# EAGLE design Flutter_ARM_R5_Basic (EAGLE 6.5.0)
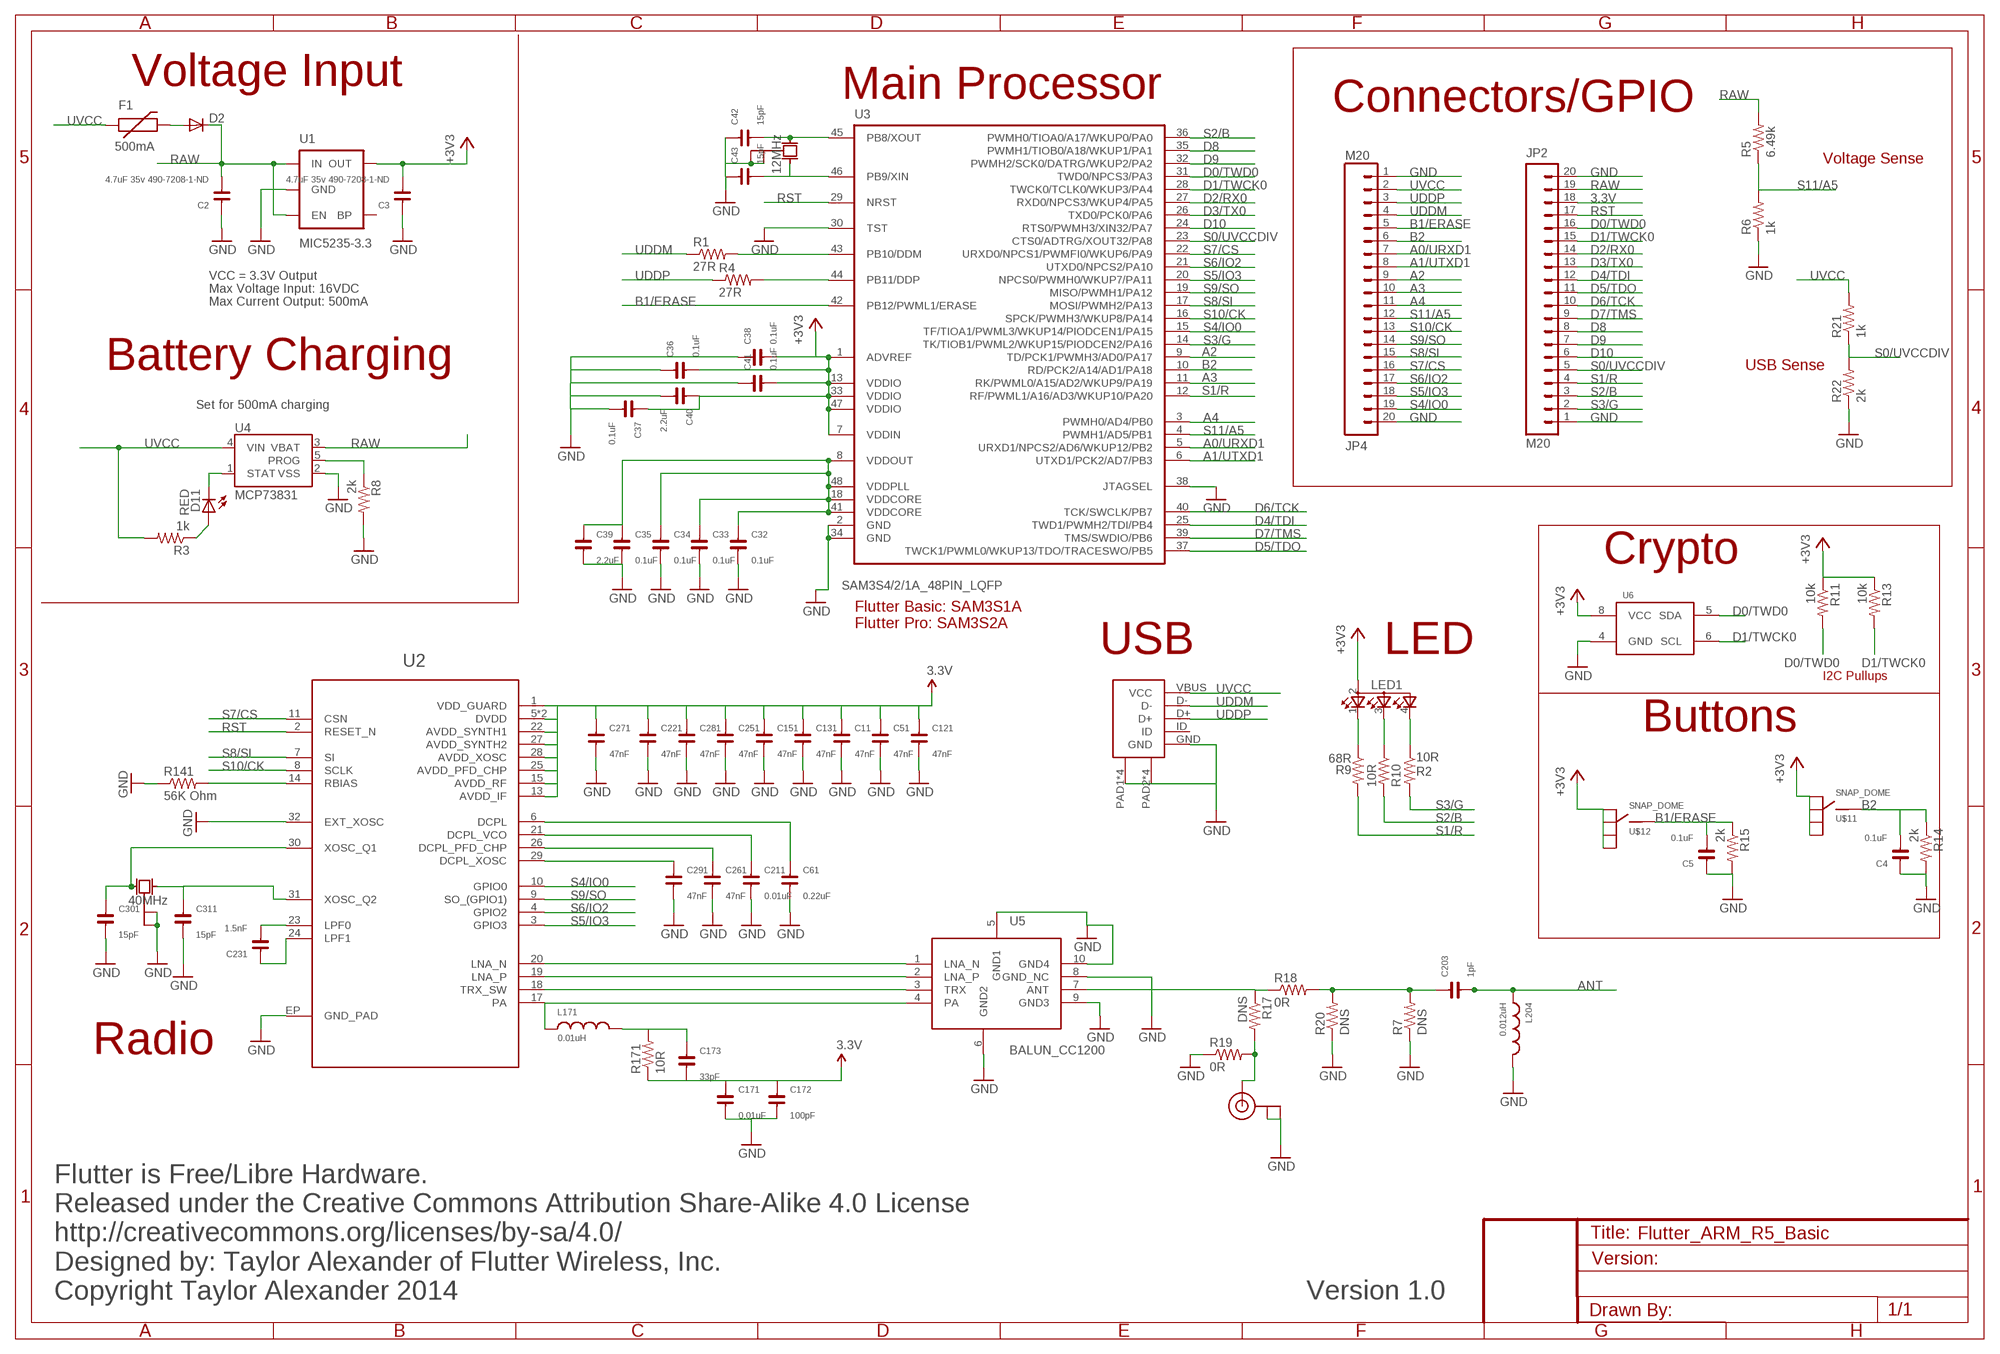
[diagram p0: schematic, sheet 1]

## Parts
C2  4.7uF 35v 490-7208-1-ND  CAPACITOR0805  [0808-CAP]
C3  4.7uF 35v 490-7208-1-ND  CAPACITOR0805  [0808-CAP]
C4  0.1uF  CAPACITOR0402  [0402-CAP]
C5  0.1uF  CAPACITOR0402  [0402-CAP]
C11  47nF  CAPACITOR0402  [0402-CAP]
C32  0.1uF  CAPACITOR0402  [0402-CAP]
C33  0.1uF  CAPACITOR0402  [0402-CAP]
C34  0.1uF  CAPACITOR0402  [0402-CAP]
C35  0.1uF  CAPACITOR0402  [0402-CAP]
C36  0.1uF  CAPACITOR0402  [0402-CAP]
C37  0.1uF  CAPACITOR0402  [0402-CAP]
C38  0.1uF  CAPACITOR0402  [0402-CAP]
C39  2.2uF  CAPACITOR0402  [0402-CAP]
C40  2.2uF  CAPACITOR0402  [0402-CAP]
C41  0.1uF  CAPACITOR0402  [0402-CAP]
C42  15pF  CAPACITOR0402  [0402-CAP]
C43  15pF  CAPACITOR0402  [0402-CAP]
C51  47nF  CAPACITOR0402  [0402-CAP]
C61  0.22uF  CAPACITOR0402  [0402-CAP]
C121  47nF  CAPACITOR0402  [0402-CAP]
C131  47nF  CAPACITOR0402  [0402-CAP]
C151  47nF  CAPACITOR0402  [0402-CAP]
C171  0.01uF  CAPACITOR0402  [0402-CAP]
C172  100pF  CAPACITOR0402  [0402-CAP]
C173  33pF  CAPACITOR0402  [0402-CAP]
C203  1pF  CAPACITOR0402  [0402-CAP]
C211  0.01uF  CAPACITOR0402  [0402-CAP]
C221  47nF  CAPACITOR0402  [0402-CAP]
C231  1.5nF  CAPACITOR0402  [0402-CAP]
C251  47nF  CAPACITOR0402  [0402-CAP]
C261  47nF  CAPACITOR0402  [0402-CAP]
C271  47nF  CAPACITOR0402  [0402-CAP]
C281  47nF  CAPACITOR0402  [0402-CAP]
C291  47nF  CAPACITOR0402  [0402-CAP]
C301  15pF  CAPACITOR0402  [0402-CAP]
C311  15pF  CAPACITOR0402  [0402-CAP]
D2  DIODESOD  [SOD-323]
D11  RED  LED0603  [LED-0603]
F1  500mA  PTC0603  [0603-PTC]
JP2  M20  [1X20]
JP4  M20  [1X20]
L171  0.01uH  INDUCTOR0402  [0402-IND]
L204  0.012uH  INDUCTOR0402  [0402-IND]
LED1  TOPLED-3  [P-LCC-4-3]
R1  27R  RESISTOR0402  [0402-RES]
R2  10R  RESISTOR0402  [0402-RES]
R3  1k  RESISTOR0402  [0402-RES]
R4  27R  RESISTOR0402  [0402-RES]
R5  6.49k  RESISTOR0402  [0402-RES]
R6  1k  RESISTOR0402  [0402-RES]
R7  DNS  RESISTOR0402  [0402-RES]
R8  2k  RESISTOR0402  [0402-RES]
R9  68R  RESISTOR0402  [0402-RES]
R10  10R  RESISTOR0402  [0402-RES]
R11  10k  RESISTOR0402  [0402-RES]
R13  10k  RESISTOR0402  [0402-RES]
R14  2k  RESISTOR0402  [0402-RES]
R15  2k  RESISTOR0402  [0402-RES]
R17  DNS  RESISTOR0402  [0402-RES]
R18  0R  RESISTOR0402  [0402-RES]
R19  0R  RESISTOR0402  [0402-RES]
R20  DNS  RESISTOR0402  [0402-RES]
R21  1k  RESISTOR0402  [0402-RES]
R22  2k  RESISTOR0402  [0402-RES]
R141  56K Ohm  RESISTOR0402  [0402-RES]
R171  10R  RESISTOR0402  [0402-RES]
U1  MIC5235-3.3  V_REG_LDOSMD  [SOT23-5]
U2  CC1200  [QFN-32]
U3  SAM3S4/2/1A_48PIN_LQFP  [LQFP48]
U4  MCP73831  [SOT23-5]
U5  BALUN_CC1200  [IPC_BALUN_CC1200]
U6  ATSHA204/ATECC108UDFN  [UDFN_8_ATSHA204]
U7  U.FL  [U.FL]
U$2  MICRO_USB  [MICRO-USB-SLOT-2]
U$11  SNAP_DOME  [12MM_SNAP_DOME_SMALLER]
U$12  SNAP_DOME  [12MM_SNAP_DOME_SMALLER]
X1  12MHz  XTAL_ABRACON_4_PINABM8G  [XTAL_ABRACON_ABM8G_3.2MMX2.5MM]
X2  40MHz  XTAL_ABRACON_4_PINEPSON  [XTAL_EPSON_FA_128_2MMX1.6MM]

## Nets
3.3V: C3.2 C11.1 C36.2 C37.1 C38.2 C40.1 C41.2 C51.1 C121.1 C131.1 C151.1 C171.1 C172.1 C173.2 C221.1 C251.1 C271.1 C281.1 JP2.18 LED1.2(A2) R11.1 R13.1 R171.1 U1.5(OUT) U2.1(VDD_GUARD) U2.5(DVDD) U2.12(DVDD) U2.13(AVDD_IF) U2.15(AVDD_RF) U2.22(AVDD_SYNTH1) U2.25(AVDD_PFD_CHP) U2.27(AVDD_SYNTH2) U2.28(AVDD_XOSC) U3.1(ADVREF) U3.7(VDDIN) U3.13(VDDIO) U3.33(VDDIO) U3.47(VDDIO) U6.8(VCC) U$11.P$1 U$11.P$2 U$11.P$3 U$11.P$4 U$12.P$1 U$12.P$2 U$12.P$3 U$12.P$4 ; supply symbol labelled +3V3
+1.8V [Power]: C32.1 C33.1 C34.1 C35.1 C39.1 U3.8(VDDOUT) U3.18(VDDCORE) U3.41(VDDCORE) U3.48(VDDPLL)
A0/URXD1: JP4.7 U3.5(URXD1/NPCS2/AD6/WKUP12/PB2)
A1/UTXD1: JP4.8 U3.6(UTXD1/PCK2/AD7/PB3)
A2: JP4.9 U3.9(TD/PCK1/PWMH3/AD0/PA17)
A3: JP4.10 U3.11(RK/PWML0/A15/AD2/WKUP9/PA19)
A4: JP4.11 U3.3(PWMH0/AD4/PB0)
ANT: C203.2 L204.1
B1/ERASE: C5.2 JP4.5 R15.1 U3.42(PB12/PWML1/ERASE) U$12.CENTER
B2: C4.2 JP4.6 R14.1 U3.10(RD/PCK2/A14/AD1/PA18) U$11.CENTER
D0/TWD0: JP2.16 R11.2 U3.31(TWD0/NPCS3/PA3) U6.5(SDA)
D1/TWCK0: JP2.15 R13.2 U3.28(TWCK0/TCLK0/WKUP3/PA4) U6.6(SCL)
D2/RX0: JP2.14 U3.27(RXD0/NPCS3/WKUP4/PA5)
D3/TX0: JP2.13 U3.26(TXD0/PCK0/PA6)
D4/TDI: JP2.12 U3.25(TWD1/PWMH2/TDI/PB4)
D5/TDO: JP2.11 U3.37(TWCK1/PWML0/WKUP13/TDO/TRACESWO/PB5)
D6/TCK: JP2.10 U3.40(TCK/SWCLK/PB7)
D7/TMS: JP2.9 U3.39(TMS/SWDIO/PB6)
D8: JP2.8 U3.35(PWMH1/TIOB0/A18/WKUP1/PA1)
D9: JP2.7 U3.32(PWMH2/SCK0/DATRG/WKUP2/PA2)
D10: JP2.6 U3.24(RTS0/PWMH3/XIN32/PA7)
GND [Power]: C2.1 C3.1 C4.1 C5.1 C11.2 C32.2 C33.2 C34.2 C35.2 C36.1 C37.2 C38.1 C39.2 C40.2 C41.1 C42.1 C43.1 C51.2 C61.2 C121.2 C131.2 C151.2 C171.2 C172.2 C211.2 C221.2 C251.2 C261.2 C271.2 C281.2 C291.2 C301.2 C311.2 JP2.1 JP2.20 JP4.1 JP4.20 L204.2 R6.1 R7.1 R8.2 R14.2 R15.2 R19.1 R20.1 R22.1 R141.1 U1.2(GND) U2.32(EXT_XOSC) U2.EP(GND_PAD) U3.2(GND) U3.30(TST) U3.34(GND) U3.38(JTAGSEL) U4.2(VSS) U5.5(GND1) U5.6(GND2) U5.8(GND_NC) U5.9(GND3) U5.10(GND4) U6.4(GND) U7.P$1(GND) U7.P$2(GND) U$2.GND U$2.PAD1 U$2.PAD2 U$2.PAD3 U$2.PAD4 U$2.PAD5 U$2.PAD6 U$2.PAD7 U$2.PAD8 X1.P$2(GND) X1.P$4(GND) X2.2(GND) X2.4(GND)
LNA_N: U2.20(LNA_N) U5.1(LNA_N)
LNA_P: U2.19(LNA_P) U5.2(LNA_P)
N$1: C61.1 U2.6(DCPL)
N$2: R141.2 U2.14(RBIAS)
N$3: C231.1 U2.24(LPF1)
N$4: C231.2 U2.23(LPF0)
N$5: C211.1 U2.21(DCPL_VCO)
N$6: D11.A R3.1
N$7: C173.1 L171.2 R171.2
N$8: C203.1 R7.2 R18.2 R20.2
N$10: D2.2(A) F1.2
N$11: R17.1 R18.1 U5.7(ANT)
N$13: R17.2 R19.2 U7.P$3(SIGNAL)
N$14: C311.1 U2.31(XOSC_Q2) X2.1(X1)
N$15: C261.1 U2.26(DCPL_PFD_CHP)
N$16: C301.1 U2.30(XOSC_Q1) X2.3(X2)
N$17: C291.1 U2.29(DCPL_XOSC)
N$18: LED1.1(CRED) R9.1
N$20: LED1.4(CGREEN) R2.1
N$35: C42.2 U3.45(PB8/XOUT) X1.P$3(X2)
N$36: C43.2 U3.46(PB9/XIN) X1.P$1(X1)
PA: L171.1 U2.17(PA) U5.4(PA)
PROG: R8.1 U4.5(PROG)
RAW [Power]: C2.2 D2.1(C) JP2.19 R5.2 U1.1(IN) U1.3(EN) U4.3(VBAT)
RST: JP2.17 U2.2(RESET_N) U3.29(NRST)
S0/UVCCDIV: JP2.5 R21.1 R22.2 U3.23(CTS0/ADTRG/XOUT32/PA8)
S1/R: JP2.4 R9.2 U3.12(RF/PWML1/A16/AD3/WKUP10/PA20)
S2/B: JP2.3 R10.2 U3.36(PWMH0/TIOA0/A17/WKUP0/PA0)
S3/G: JP2.2 R2.2 U3.14(TK/TIOB1/PWML2/WKUP15/PIODCEN2/PA16)
S4/IO0: JP4.19 U2.10(GPIO0) U3.15(TF/TIOA1/PWML3/WKUP14/PIODCEN1/PA15)
S5/IO3: JP4.18 U2.3(GPIO3) U3.20(NPCS0/PWMH0/WKUP7/PA11)
S6/IO2: JP4.17 U2.4(GPIO2) U3.21(UTXD0/NPCS2/PA10)
S7/CS: JP4.16 U2.11(CSN) U3.22(URXD0/NPCS1/PWMFI0/WKUP6/PA9)
S8/SI: JP4.15 U2.7(SI) U3.17(MOSI/PWMH2/PA13)
S9/SO: JP4.14 U2.9(SO_(GPIO1)) U3.19(MISO/PWMH1/PA12)
S10/CK: JP4.13 U2.8(SCLK) U3.16(SPCK/PWMH3/WKUP8/PA14)
S11/A5: JP4.12 R5.1 R6.2 U3.4(PWMH1/AD5/PB1)
STAT: D11.C U4.1(STAT)
TRX_SW: U2.18(TRX_SW) U5.3(TRX)
U7: LED1.3(CBLUE) R10.1
UDDC_+: R4.2 U3.44(PB11/DDP)
UDDC_-: R1.2 U3.43(PB10/DDM)
UDDM: JP4.4 R1.1 U$2.D-
UDDP: JP4.3 R4.1 U$2.D+
UVCC: F1.1 JP4.2 R3.2 R21.2 U4.4(VIN) U$2.VBUS(VCC)
Unconnected: U1.4(BP) U$2.ID

## Notes on the sheet
- Voltage Input | Main Processor
- Connectors/GPIO
- Voltage Sense
- VCC = 3.3V Output
- Max Voltage Input: 16VDC
- Max Current Output: 500mA
- Battery Charging | USB Sense
- Set for 500mA charging
- Crypto
- Flutter Basic: SAM3S1A
  Flutter Pro: SAM3S2A
- USB | LED
- I2C Pullups
- Buttons
- Radio
- Flutter is Free/Libre Hardware.
  Released under the Creative Commons Attribution Share-Alike 4.0 License
  http://creativecommons.org/licenses/by-sa/4.0/
  Designed by: Taylor Alexander of Flutter Wireless, Inc.
  Copyright Taylor Alexander 2014
- Version 1.0

## Library data of the parts
C2-C5 C11 C32-C43 C51 C61 C121 C131 C151 C171-C173 C203 C211 C221 C231 C251 C261 C271 C281 C291 C301 C311 = Taylor:CAPACITOR
D2 = SparkFun:DIODE: Diode These are standard reverse protection diodes and small signal diodes. SMA package can handle up to about 1A. SOD-323 can handle about 200mA. What the SOD-323 package when ordering, there are some mfgs out there that are 5-pin packages.
D11 = SparkFun:LED: LEDs Standard schematic elements and footprints for 5mm, 3mm, 1206, and 0603 sized LEDs. 5mm - Spark Fun Electronics SKU : COM-00529 (and others)
F1 = Taylor:PTC: Resettable Fuse PTC Resettable Fuse. 0603 model is Bourns MF-FSMF Series like MF-FSMF050X-2
JP2 JP4 = SparkFun:M20: This is just like the LOCK variant in that the holes are staggared by 5 mil, but except for the last two holes. They are not altered from the "standard" footprint layout. This is used for a special purpose on the layout of our Graphic LCD Backpack. Make sure you want to use this device before selecting it for you project!
L171 L204 = Taylor:INDUCTOR: SRR1260_SMD_INDUCTOR http://www.bourns.com/data/global/PDFs/SRR1260.pdf 1uH-1000uH
LED1 = Taylor:TOPLED-3: http://www.us.sunled.com/products/spec/XZMDKCBDDG45S-9.pdf
R1-R11 R13-R15 R17-R22 R141 R171 = Taylor:RESISTOR: Resistor Basic schematic elements and footprints for 0603, 1206, and PTH 1/10th watt (small) resistors.
U1 = SparkFun:V_REG_LDO: Voltage Regulator LDO Standard 150mA LDO voltage regulator in SOT-23 layout. Micrel part MIC5205. BP (by-pass) pin is used to lower output noise with 470pF cap.
U2 = Taylor:CC1200
U3 = Taylor:SAM3S4/2/1A_48PIN_LQFP
U4 = SparkFun:MCP73831: Microchip's MCP73831 Miniature single cell, fully integrated Li-Ion, Li-polymer charge management controller http://ww1.microchip.com/downloads/en/DeviceDoc/21984a.pdf
U5 = Taylor:BALUN_CC1200
U6 = Taylor:ATSHA204/ATECC108
U7 = SparkFun:U.FL
U$2 = Taylor:MICRO_USB
U$11 U$12 = Taylor:SNAP_DOME
X1 X2 = Taylor:XTAL_ABRACON_4_PIN

## Net classes
0 default: width 0.152 mm, drill 0.152 mm, clearance 0.102 mm
1 Power: width 0.203 mm, drill 0.152 mm, clearance 0.102 mm

## Board
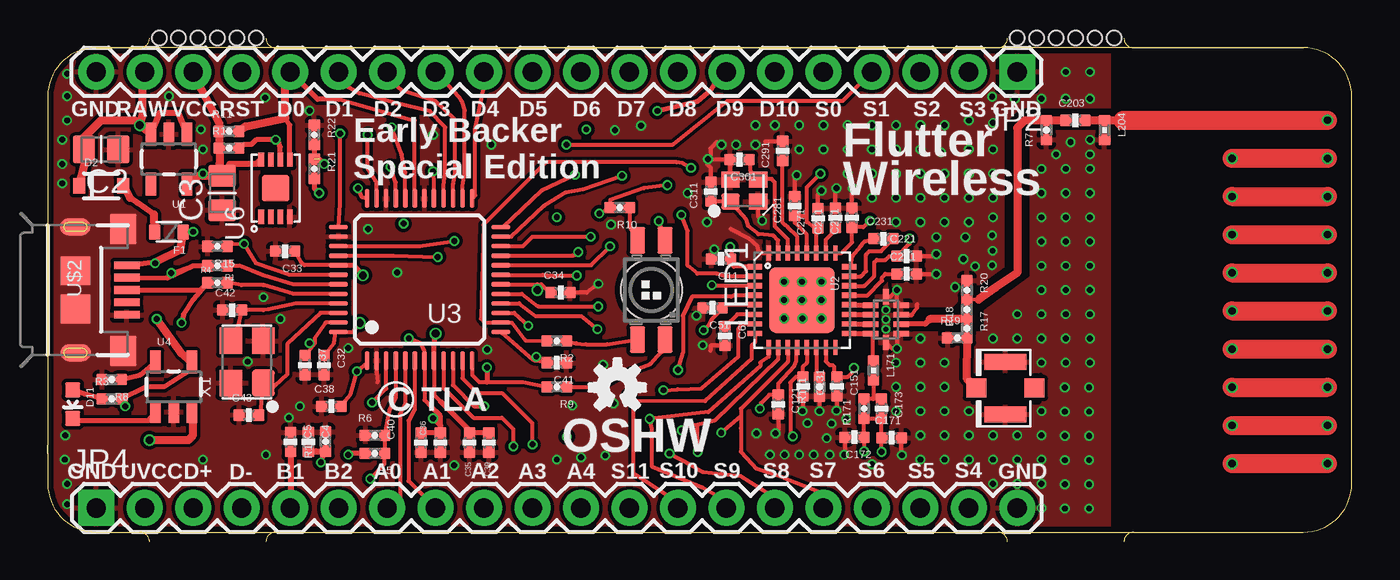
[diagram p1: board, top side]
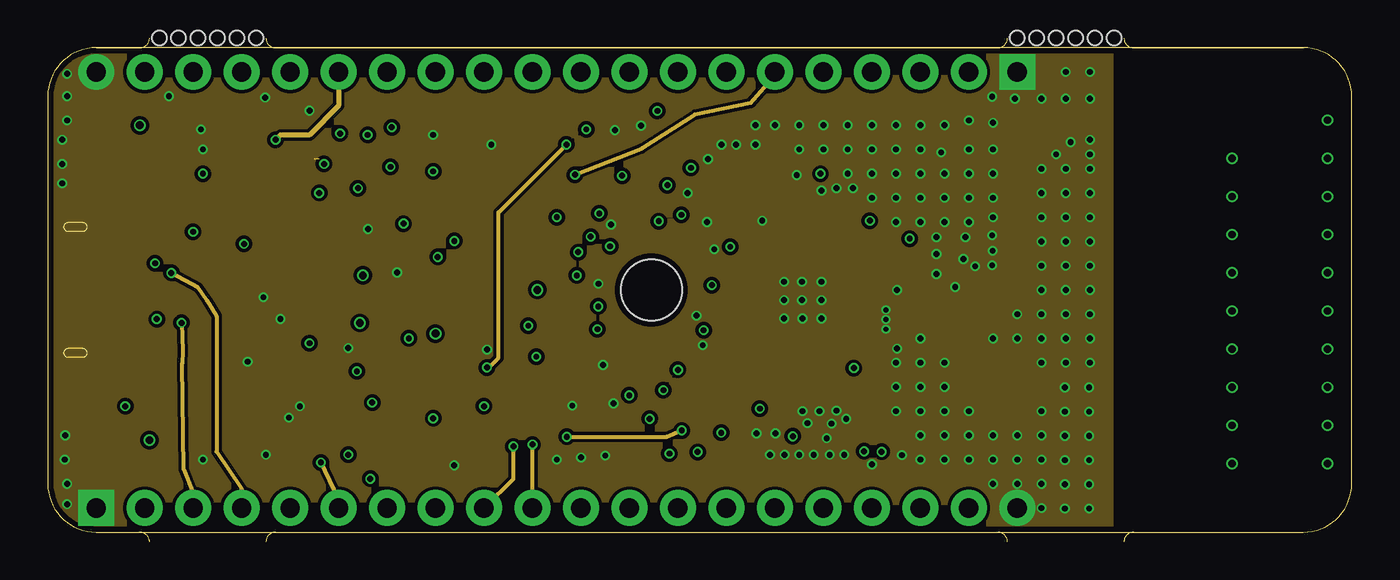
[diagram p2: board, inner layer Route2]
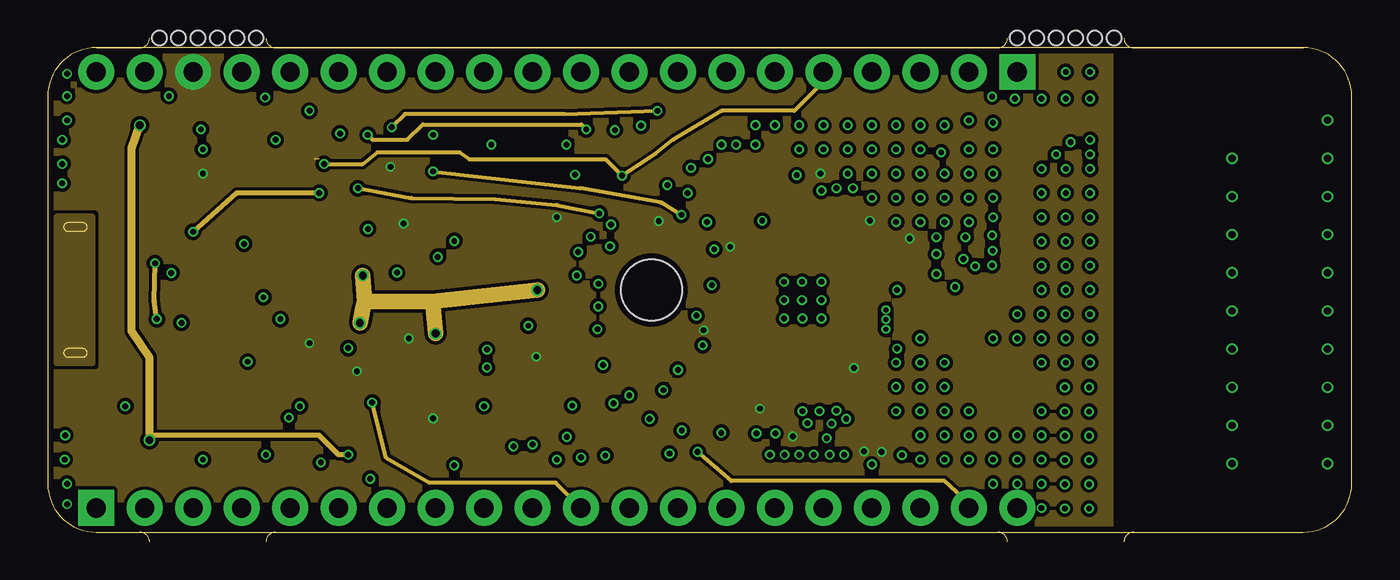
[diagram p3: board, inner layer Route15]
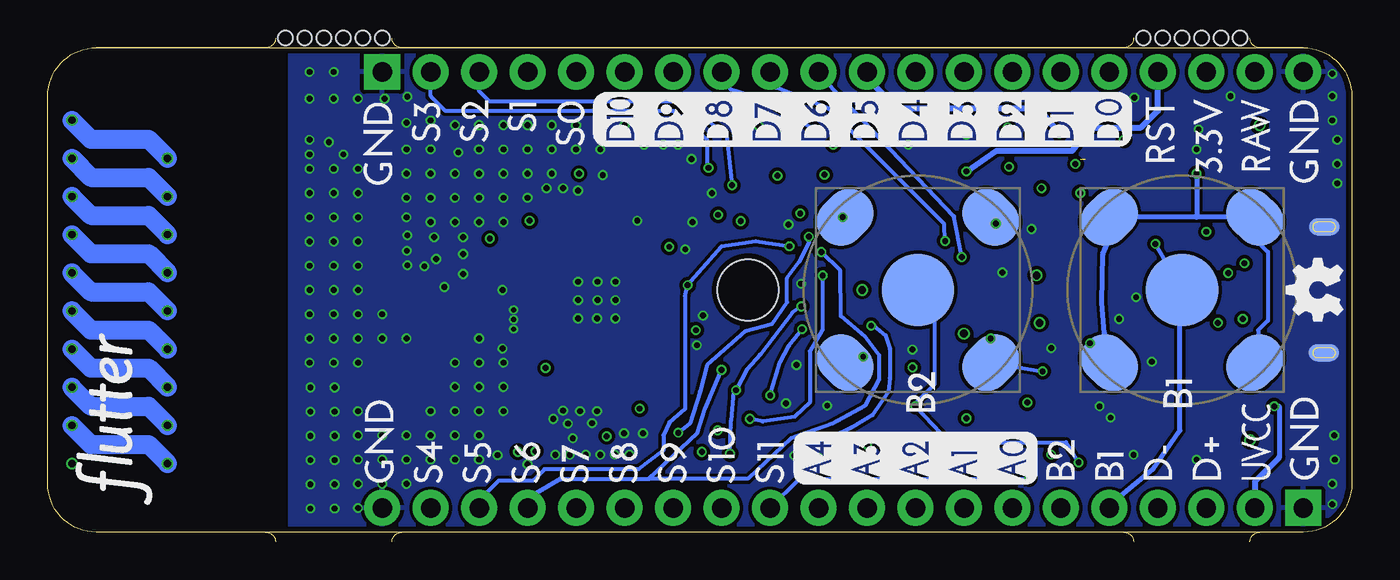
[diagram p4: board, bottom side, seen from below]

Size 68.33 x 25.4 mm. Coordinates in mm from the lower left corner, seen from the top.
Outline: 2.54,0 65.79,0 arc90 68.33,2.54 68.33,22.86 arc90 65.79,25.4 2.54,25.4 arc90 0,22.86 0,2.54 arc90 2.54,0
Copper layers (1*2+15*16): Top 0.035mm / dielectric 0.4mm / Route2 0.035mm / dielectric 0.3mm / Route15 0.035mm / dielectric 0.4mm / Bottom 0.035mm
Design rules "Flutter": minimum track width 7mil, minimum drill 12mil, track to track 7mil, track to pad 7mil, pad to pad 7mil, via to via 7mil, smd to smd 0mil, copper to edge 12mil, drill to drill 8mil, minimum pad ring 8mil, minimum via ring 4mil, stop-mask expansion 4mil, vias tented up to drill 25mil, thermal gap 8mil
Holes 0.76 mm at 6.86,25.91 7.87,25.91 8.89,25.91 9.91,25.91 10.92,25.91 50.8,25.91 51.82,25.91 52.83,25.91 53.85,25.91 54.86,25.91 5.84,25.91 55.88,25.91
tRestrict: area 37.8,10.4 to 41.4,14; area 45.5,10.7 to 55.8,22.1; area 48.5,6.8 to 52,8.2
Milling: 20 lines

### Footprints (pad centres in the part's own frame; a part is rotated, then mirrored left to right if it is on the bottom)
0808-CAP = smd 1.15 x 1.45: 1 -0.9,0; 2 0.9,0
0402-CAP = smd 0.6 x 0.6: 1 -0.5,0; 2 0.5,0
SOD-323 = smd 0.63 x 0.83: 1 -1.15,0; 2 1.15,0
LED-0603 = smd 0.8 x 0.8: A 0,-0.75; C 0,0.75
0603-PTC = smd 0.6 x 0.8: 1 -0.74,0; 2 0.74,0
1X20 = drill 1.016 pad 1.88 square: 1 0,0 | drill 1.016 pad 1.88: 2 2.54,0; 3 5.08,0; 4 7.62,0; 5 10.16,0; 6 12.7,0; 7 15.24,0; 8 17.78,0; 9 20.32,0; 10 22.86,0; 11 25.4,0; 12 27.94,0; 13 30.48,0; 14 33.02,0; 15 35.56,0; 16 38.1,0; 17 40.64,0; 18 43.18,0; 19 45.72,0; 20 48.26,0
0402-IND = smd 0.6 x 0.6: 1 -0.5,0; 2 0.5,0
P-LCC-4-3 = smd 1.4 x 0.8: 1 2.6,0.725; 2 -2.6,0.725; 3 -2.6,-0.725; 4 2.6,-0.725 | hole 3.2: 0,0
0402-RES = smd 0.6 x 0.6: 1 -0.5,0; 2 0.5,0
SOT23-5 = smd 0.55 x 1.2: 1 -0.95,-1.3; 2 0,-1.3; 3 0.95,-1.3; 4 0.95,1.3; 5 -0.95,1.3
QFN-32 = smd 0.285 x 0.8: 1 -1.75,-2.475; 2 -1.25,-2.475; 3 -0.75,-2.475; 4 -0.25,-2.475; 5 0.25,-2.475; 6 0.75,-2.475; 7 1.25,-2.475; 8 1.75,-2.475; 17 1.75,2.475; 18 1.25,2.475; 19 0.75,2.475; 20 0.25,2.475; 21 -0.25,2.475; 22 -0.75,2.475; 23 -1.25,2.475; 24 -1.75,2.475 | smd 0.8 x 0.285: 9 2.475,-1.75; 10 2.475,-1.25; 11 2.475,-0.75; 12 2.475,-0.25; 13 2.475,0.25; 14 2.475,0.75; 15 2.475,1.25; 16 2.475,1.75; 25 -2.475,1.75; 26 -2.475,1.25; 27 -2.475,0.75; 28 -2.475,0.25; 29 -2.475,-0.25; 30 -2.475,-0.75; 31 -2.475,-1.25; 32 -2.475,-1.75 | smd 3.45 x 3.45: EP 0,0
LQFP48 = smd 0.25 x 1: 1 -2.75,-4.25; 2 -2.25,-4.25; 3 -1.75,-4.25; 4 -1.25,-4.25; 5 -0.75,-4.25; 6 -0.25,-4.25; 7 0.25,-4.25; 8 0.75,-4.25; 9 1.25,-4.25; 10 1.75,-4.25; 11 2.25,-4.25; 12 2.75,-4.25; 25 2.75,4.25; 26 2.25,4.25; 27 1.75,4.25; 28 1.25,4.25; 29 0.75,4.25; 30 0.25,4.25; 31 -0.25,4.25; 32 -0.75,4.25; 33 -1.25,4.25; 34 -1.75,4.25; 35 -2.25,4.25; 36 -2.75,4.25 | smd 1 x 0.25: 13 4.25,-2.75; 14 4.25,-2.25; 15 4.25,-1.75; 16 4.25,-1.25; 17 4.25,-0.75; 18 4.25,-0.25; 19 4.25,0.25; 20 4.25,0.75; 21 4.25,1.25; 22 4.25,1.75; 23 4.25,2.25; 24 4.25,2.75; 37 -4.25,2.75; 38 -4.25,2.25; 39 -4.25,1.75; 40 -4.25,1.25; 41 -4.25,0.75; 42 -4.25,0.25; 43 -4.25,-0.25; 44 -4.25,-0.75; 45 -4.25,-1.25; 46 -4.25,-1.75; 47 -4.25,-2.25; 48 -4.25,-2.75
IPC_BALUN_CC1200 = smd 0.8 x 0.3: 1 -0.8,0.75; 2 -0.8,0.25; 3 -0.8,-0.25; 4 -0.8,-0.75; 6 0.8,-0.75; 7 0.8,-0.25; 8 0.8,0.25; 9 0.8,0.75 | smd 0.3 x 0.8: 5 0,-1.2; 10 0,1.2
UDFN_8_ATSHA204 = smd 0.3 x 0.75: 1 -0.75,-1.5; 2 -0.25,-1.5; 3 0.25,-1.5; 4 0.75,-1.5; 5 0.75,1.5; 6 0.25,1.5; 7 -0.25,1.5; 8 -0.75,1.5 | smd 1.46 x 1.36: PAD 0,0
U.FL = smd 2.2 x 0.85: P$1 0,1.375; P$2 0,-1.375 | smd 1.05 x 1: P$3 1.525,0; P$4 -1.525,0
MICRO-USB-SLOT-2 = smd 0.4 x 1.35: D+ 0,2.7; D- -0.65,2.7; GND 1.3,2.7; ID 0.65,2.7; VBUS -1.3,2.7 | smd 1.5 x 1.55: PAD1 -1,0; PAD2 1,0.01 | smd 0.9 x 1.6: PAD3 -3.3,0; PAD4 3.3,0.01 | smd 1.6 x 1.4: PAD5 -3.2,2.5; PAD6 3.2,2.5 | smd 0.9 x 1.6 bottom: PAD7 -3.3,0; PAD8 3.3,0.01
12MM_SNAP_DOME_SMALLER = smd 3.81 x 3.81: CENTER 0,0 | smd 3.175 x 2.54 rotated 45: P$1 3.81,-3.81; P$3 -3.81,3.81 | smd 3.175 x 2.54 rotated 315: P$2 -3.81,-3.81; P$4 3.81,3.81
XTAL_ABRACON_ABM8G_3.2MMX2.5MM = smd 1.397 x 1.194: P$1 -1.105,-0.851; P$2 1.105,-0.851; P$3 1.105,0.851; P$4 -1.105,0.851
XTAL_EPSON_FA_128_2MMX1.6MM = smd 0.95 x 0.85: 1 -0.725,-0.575; 2 0.725,-0.575; 3 0.725,0.575; 4 -0.725,0.575

### Placement (x,y rotation side)
C2  2.79,20.07 180 top
C3  9.14,17.78 90 top
C4  13.65,4.74 270 top
C5  12.72,4.73 270 top
C11  35.28,14.33 180 top
C32  14.48,8.76 270 top
C33  12.45,14.73 180 top
C34  26.88,12.57 0 top
C35  22.1,4.7 270 top
C36  20.57,4.7 90 top
C37  13.48,8.76 270 top
C38  14.86,6.6 0 top
C39  23.11,4.7 270 top
C40  19.56,4.7 270 top
C41  26.67,8.89 180 top
C42  9.66,11.65 0 top
C43  10.54,6.14 0 top
C51  34.83,11.76 180 top
C61  35.48,10.29 270 top
C121  38.28,6.71 270 top
C131  39.57,7.65 270 top
C151  41.35,7.65 270 top
C171  44.22,4.95 0 top
C172  42.27,4.98 180 top
C173  43.69,6.48 270 top
C203  53.85,21.59 0 top
C211  45.01,13.54 0 top
C221  45.01,14.48 0 top
C231  43.79,15.39 0 top
C251  42.14,16.48 90 top
C261  41.27,16.48 90 top
C271  40.36,16.46 90 top
C281  39.14,17.09 90 top
C291  38.51,19.99 90 top
C301  36.25,19.53 180 top
C311  34.75,17.86 90 top
D2  2.79,18.16 0 top
D11  1.32,6.72 180 top
F1  6.35,15.75 180 top
JP2  50.8,24.13 180 top
JP4  2.54,1.27 0 top
L171  43.26,8.48 270 top
L204  55.37,21.08 270 top
LED1  31.62,12.7 270 top
R1  8.89,13.97 0 top
R2  26.67,10.03 180 top
R3  3.36,6.99 0 top
R4  8.89,13.08 0 top
R5  17.14,4.14 180 top
R6  17.14,5.08 0 top
R7  52.32,21.08 90 top
R8  3.35,8 180 top
R9  26.67,7.62 180 top
R10  29.97,17.02 180 top
R11  9.5,21.01 0 top
R13  9.5,20.13 0 top
R14  14.56,4.75 90 top
R15  8.89,14.99 180 top
R17  48.16,10.69 270 top
R18  48.16,11.67 90 top
R19  47.66,10.19 0 top
R20  48.16,12.69 270 top
R21  13.97,19.05 270 top
R22  13.97,20.83 270 top
R141  40.44,7.62 90 top
R171  42.77,6.48 90 top
U1  6.35,19.56 180 top
U2  39.52,12.17 270 top
U3  19.49,13.24 0 top
U4  6.6,7.62 0 top
U5  43.92,11.15 0 top
U6  11.94,18.03 0 top
U7  50.18,7.55 180 top
U$1  OSHW-LOGOS  [OSHW-LOGO-S]  29.84,7.58 0 top
U$2  1.45,12.7 270 top
U$11  22.73,12.7 0 bottom
U$12  8.89,12.7 180 bottom
X1  10.45,8.93 90 top
X2  36.5,17.91 0 top

### Tracks (layer width: path | path; a pad name or v marks a point on that pad's centre or on a via)
3.3V  (via drill 0.3)
  Top 0.203: U2.5 35.45,11.92 C51.1 | U2.1 35.94,13.92 C11.1 35.78,14.14 35.84,14.71 v35.76,14.96 | U2.22 42.79,12.92 43.31,13.44 43.31,14.15 43.43,14.28 43.89,14.28 44.09,14.48 C221.1 45.16,15.13 v45.16,15.39 | U2.27 40.27,15.87 arc-90 C271.1 40.15,15.96 39.78,16.26 39.78,16.71 | U2.25 41.59,14.64 42.14,15.19 C251.1 42.73,15.98 v43.08,16.33 | U2.28 39.77,15.6 39.14,16.23 C281.1 39.66,16.59 39.78,16.71 | U2.13 39.77,8.89 39.55,8.66 39.55,8.17 C131.1 39.21,8.14 38.91,7.85 38.91,5.16 v39.04,5.03 | U2.12 39.22,9.64 39.22,8.99 39.17,8.84 39.12,8.71 38.28,7.8 C121.1 37.81,7.21 37.36,6.76 37.36,6.53 v37.31,6.48 | 39.78,16.71 39.78,18.09 v40.49,18.8 | U2.15 40.77,8.96 40.97,8.76 41.12,8.76 41.2,8.69 41.2,8.3 C151.1 41.93,8.14 42.19,8.41 42.19,8.56 v42.24,8.61 | C171.1 43.69,4.99 C173.2 R171.1 C172.1 v42.77,4.24 | v43.69,4.22 43.69,4.95 | C51.1 35.42,11.78 | U3.33 18.24,18.34 v17.96,19.15 | 20.07,6.6 19.74,6.93 U3.7 19.74,9.47 19.56,9.91 v18.92,10.16 | U3.1 16.74,8.86 v16.2,8.44 15.87,7.23 C38.2 | U3.47 14.55,10.99 13.99,10.18 13.99,9.91 | 13.99,9.91 C37.1 | 23.84,10.39 U3.13 25.43,9.03 25.52,9 | v13.72,9.91 13.99,9.91 | C41.2 25.52,9 | v34.37,10.59 34.67,10.9 34.8,11.18 35.42,11.8 C51.1 | v32.01,16.31 LED1.2 | v25.6,9.21 25.52,9
  Top 0.254: C40.1 C36.2 20.57,5.59 20.57,6.1 20.07,6.6
  Top 0.305: v20.19,5.97 20.57,5.59 | U6.8 11.15,19.53 10.92,19.3 9.51,19.3 C3.2
  Top 0.406: U1.5 v8.13,18.8 8.13,18.68 C3.2 9,19.3 R13.1 R11.1 9,21.43 7.6,24.1
  Bottom 0.203: v18.64,16.18 U$11.P$4 | v16.2,8.44 U$11.P$1 v18.92,10.16 | U$11.P$2 25.85,9.21 v25.6,9.21 | U$12.P$2 5.08,15.38 4.4,14.7 4.4,11.1 4.9,10.6 4.9,9.07 U$12.P$3
  Bottom 0.254: v8.13,18.8 8.13,16.51 | U$12.P$2 8.13,16.51 | 8.13,16.51 12.19,16.51 | 12.19,16.51 U$12.P$1 | v26.67,16.52 U$11.P$3 | U$12.P$4 12.75,9.77 12.95,10.43 13.1,12.04 13.04,14.58 12.19,16.51
  pour Route15 (rank 2, no thermals): 55.63,25.4 55.63,0 0,0 -0.05,25.4
+1.8V  (via drill 0.41)
  Top 0.203: U3.18 25.65,12.99 | 25.65,12.99 25.87,12.99 26.16,12.7 26.37,12.7 C34.1 | U3.8 20.24,7.2 20.57,6.86 | U3.41 13.44,13.99 13.28,14.15 C33.1 | C32.1 14.99,9.91 15.07,10.49 U3.48 15.98,10.49 v16.36,10.97 | v25.65,12.7 25.65,12.99
  Top 0.254: C39.1 C35.1 22.1,5.33 20.57,6.86 | U3.41 16.03,13.99 v16.51,13.46 | U3.8 20.24,9.82 v20.32,10.41
  Route15 0.813: v16.51,13.46 16.61,12.1 | 16.61,12.1 16.51,11.68 v16.36,10.97 | v25.65,12.7 20.17,12.1 | 20.17,12.1 16.61,12.1 | v20.32,10.41 20.17,12.1
A0/URXD1
  Top 0.203: U3.5 18.74,6.74 18.45,6.2 18.45,1.69 JP4.7
A1/UTXD1
  Top 0.203: U3.6 19.24,6.44 18.9,5.85 18.9,2.69 JP4.8
A2  (via drill 0.3)
  Top 0.203: U3.9 20.74,7.56 22.3,6 23.8,6 24.4,5.4 v24.4,4.5
  Route2 0.203: JP4.9 24.4,2.81 v24.4,4.5
A3  (via drill 0.3)
  Top 0.203: U3.11 21.74,8.06 22.5,7.3 23.8,7.3 25.4,5.7 v25.4,4.6
  Route2 0.203: JP4.10 v25.4,4.6
A4  (via drill 0.3)
  Top 0.203: v17,6.8 17.74,7.54 U3.3
  Route15 0.203: JP4.11 26.61,2.6 20.01,2.6 17.74,3.9 v17,6.8
ANT  (via drill 0.38)
  Top 0.406: 56.34,21.6 56.25,21.58 L204.1 | L204.1 | C203.2 L204.1
  Top 1: 56.34,21.6 v67.06,21.6 | v62.05,19.6 v67.06,19.6 | v62.05,15.6 v67.06,15.6 | v62.05,17.6 v67.06,17.6 | v62.05,11.6 v67.06,11.6 | v62.05,13.6 v67.06,13.6 | v62.05,9.6 v67.06,9.6 | v62.05,5.6 v67.06,5.6 | v62.05,3.6 v67.06,3.6 | v62.05,7.6 v67.06,7.6
  Bottom 1: v67.06,21.6 66.06,20.6 63.04,20.6 v62.05,19.6 | v62.05,17.6 63.04,18.6 66.06,18.6 v67.06,19.6 | v67.06,17.6 66.06,16.6 63.04,16.6 v62.05,15.6 | v62.05,13.6 63.04,14.6 66.06,14.6 v67.06,15.6 | v67.06,13.6 66.06,12.6 63.04,12.6 v62.05,11.6 | v62.05,9.6 63.04,10.6 66.06,10.6 v67.06,11.6 | v67.06,9.6 66.06,8.6 63.04,8.6 v62.05,7.6 | v62.05,5.6 63.04,6.6 66.06,6.6 v67.06,7.6 | v62.05,3.6 63.04,4.6 66.06,4.6 v67.06,5.6
B1/ERASE  (via drill 0.3)
  Top 0.203: U3.42 12.67,13.49 10.92,14.1 v10.29,15.11 9.69,15.15 R15.1
  Top 0.305: C5.2 12.72,2.01 JP4.5
  Bottom 0.203: v10.29,15.11 U$12.CENTER | 12.28,1.74 12.53,1.44 JP4.5
  Bottom 0.254: U$12.CENTER 9,11.43 9,5.33 10.41,3.3 12.28,1.74
B2  (via drill 0.3)
  Top 0.203: U3.10 21.24,7.72 22.35,6.6 v22.86,6.6
  Top 0.254: R14.1 14.33,3.76 v14.31,3.65
  Top 0.305: C4.2 14.04,4.24 R14.1
  Route2 0.203: JP4.6 14.99,2.29 v14.31,3.65
  Bottom 0.203: v14.31,3.65 14.98,4.72 21.07,4.72 v22.86,6.6 22.86,6.77 21.84,7.78 21.84,12.57 U$11.CENTER
D0/TWD0
  Top 0.203: U3.31 19.24,21.59 15.26,22.7 | 12.65,23.62 12.66,24.08
  Top 0.254: 12.66,24.08 12.66,24.09 JP2.16 14.13,22.7 15.26,22.7 | U6.5 12.69,21.35 12.45,21.72
  Top 0.406: R11.2 10.35,21.27 12.45,21.72 12.45,23.42 12.65,23.62
D1/TWCK0  (via drill 0.3)
  Top 0.203: U3.28 20.74,18.2 20.83,18.8 20.83,21.23 20.01,22.08 18.24,22.49 16.32,23.01 15.22,23.61 15.22,24.11 JP2.15
  Top 0.254: R13.2 10.32,20.32 10.67,20.32 10.92,20.57 v11.94,20.57 12.06,20.57 12.19,20.2 U6.6
  Route2 0.254: JP2.15 15.24,22.35 13.72,20.83 12.19,20.83 v11.94,20.57
D2/RX0
  Top 0.203: U3.27 21.24,18.19 21.34,18.8 21.34,21.64 20.32,22.59 18.56,23.14 17.78,23.82 JP2.14
D3/TX0
  Top 0.203: U3.26 21.74,18.18 21.84,18.8 21.84,22.09 21.67,22.61 21.56,22.81 20.33,24.13 JP2.13
D4/TDI
  Top 0.203: U3.25 22.4,17.66 22.4,21.1 22.86,23.36 JP2.12
D5/TDO  (via drill 0.3)
  Top 0.203: U3.37 15.32,17.2 v15.32,20.9
  Bottom 0.305: v15.32,20.9 16.38,22.2 23.8,22.2 25.4,23.8 JP2.11
D6/TCK  (via drill 0.3)
  Top 0.203: U3.40 18.11,14.49 v20.43,14.43
  Bottom 0.203: v20.43,14.43 20.84,16.55 27.94,24.04 JP2.10
D7/TMS  (via drill 0.3)
  Top 0.203: U3.39 19.5,14.99 v21.31,15.27
  Bottom 0.203: v21.31,15.27 21.35,16.15 27.4,22.2 30.15,23.3 JP2.9
D8  (via drill 0.3)
  Top 0.203: U3.35 17.24,18.32 16.76,19.05 v16.76,20.83
  Route15 0.203: v28.22,21.12 27.96,21.37 19.64,21.37 18.84,20.57 17.02,20.57 v16.76,20.83
  Bottom 0.203: v28.22,21.12 30.62,22.61 32.54,23.21 33.02,23.79 JP2.8
D9  (via drill 0.3)
  Top 0.203: U3.32 18.74,18.86 18.54,19.81 v18.03,21.23 | 35.18,23.9 35.6,24.11 35.58,24.13 JP2.7
  Top 0.254: 35.18,23.9 34.75,23.2 34.04,22.59 v31.94,22.09
  Route15 0.203: v31.94,22.09 27.05,21.93 18.72,21.93 v18.03,21.23
D10  (via drill 0.3)
  Top 0.203: U3.24 23.87,15.99 25.91,17.93 v27.62,18.74
  Route2 0.203: v27.62,18.74 31.12,20.12 33.91,21.9 36.83,22.5 38.1,23.97 JP2.6
GND  (via drill 0.25 pad 0.3, 0.3)
  Top 0.203: C311.2 34.75,19.1 34.57,19.28 34.57,19.53 v34.59,19.56 | X2.4 35.77,19.5 C301.2 34.62,19.53 v34.59,19.56 | 35.08,20.47 34.72,20.12 34.72,19.68 v34.59,19.56 | X2.2 37.23,16.55 v37.44,16.33 | v34.92,14.83 C11.2 | C51.2 34.37,11.89 v33.99,11.36 | C271.2 40.36,17.73 v40.54,17.91 | C261.2 41.27,17.98 v41.33,18.03 | C251.2 42.14,17.98 v42.19,18.03 | 37.59,20.47 37.62,20.5 38.5,20.5 C291.2 | C61.2 34.73,9.79 34.72,9.53 | C131.2 39.57,6.38 v39.55,6.35 | R141.1 v40.44,6.35 | C151.2 41.35,6.4 v41.33,6.38 | C121.2 38.28,5.33 v38.12,5.18 | C281.2 39.14,18.62 v39.24,18.72 | C221.2 46.53,14.48 v46.56,14.58 | C211.2 v46.56,13.54 | C172.2 41.77,4.1 v41.73,4.06 | v44.76,4.04 44.72,4.07 C171.2 | U5.5 44.24,9.63 v44.5,9.63 44.5,10.19 U5.6 | U5.10 44.15,12.35 v44.5,12.7 44.5,12.12 U5.9 | U2.32 37.38,14.64 37.24,14.78 37.19,15.01 36.75,15.39 35.78,15.9 | U3.2 17.24,8.35 17.27,7.87 | v28.85,13.03 28.24,12.56 C34.2 | U5.8 45.28,11.4 45.54,11.76 45.54,11.96
  Bottom 0.203: v34.59,19.56 34.59,19.68
  other vias: 38.58,13.13 38.58,12.17 38.58,11.2 39.55,11.2 39.52,12.17 39.52,13.13 40.54,13.13 40.54,12.17 40.54,11.2 49.48,14 49.48,15.57 49.5,14.76 47.98,14.33 34.32,9.8 40.82,4.93 37.13,5.18 46.56,15.47 48.08,15.47 46.81,19.91 48.59,13.94 45.72,16.26 45.72,17.53 44.45,17.53 44.45,16.26 46.99,17.53 48.26,17.53 48.26,18.8 46.99,18.8 45.72,18.8 45.72,20.07 44.45,20.07 43.18,20.07 41.91,20.07 40.64,20.07 39.37,20.07 39.37,21.34 38.1,21.34 37.08,21.34 33.53,17.78 40.64,21.34 41.91,21.34 43.18,21.34 44.45,21.34 45.72,21.34 43.18,18.8 44.45,18.8 41.91,18.8 43.18,17.53 48.26,20.07 48.26,21.59 46.99,21.34 50.8,5.08 49.53,17.53 49.53,18.8 49.53,20.07 49.53,21.46 49.53,16.51 48.26,16.26 46.99,16.26 50.8,3.81 43.18,3.56 53.29,7.59 52.07,6.35 39.8,5.71 41.83,5.94 41.07,5.69 40.97,4.06 40.13,4.06 39.37,4.06 38.61,4.06 37.85,4.06 10.48,8.94 8.03,21.12 47.55,12.85 43.92,11.15 43.92,11.66 43.92,10.64 29.72,21.08 13.72,22.1 0.76,19.3 0.76,20.57 0.76,18.29 8.13,3.81 12.64,6.01 29.21,4.02 27.94,3.92 26.67,3.81 6.35,22.86 8.13,20.07 53.29,6.32 53.29,5.05 52.07,5.08 52.07,3.81 53.29,3.78 53.29,2.51 52.07,2.54 53.29,1.24 49.48,22.83 50.8,2.54 49.53,2.54 52.07,1.27 1.02,21.59 1.02,22.86 1.02,24.03 0.92,5.08 0.89,3.81 1.02,2.54 1.02,1.47 52.07,8.89 53.34,8.89 54.61,8.89 45.72,10.16 49.53,10.16 48.26,6.35 48.26,5.08 48.26,3.81 49.53,5.08 49.53,3.81 46.99,7.62 45.72,8.89 45.72,7.62 45.72,6.35 45.72,5.08 45.72,3.81 46.99,6.35 46.99,5.08 46.99,3.81 46.99,8.89 50.8,10.16 52.07,10.16 53.34,10.16 54.61,10.16 54.56,7.59 54.56,6.32 54.56,5.05 54.56,3.78 54.56,2.51 54.56,1.24 52.07,19.05 52.07,12.7 53.34,12.7 54.61,12.7 50.8,11.43 52.07,11.43 53.34,11.43 54.61,11.43 53.34,19.05 54.61,19.05 54.61,19.81 52.83,19.81 54.61,20.57 53.59,20.45 50.67,22.73 52.07,22.73 53.34,22.73 54.61,22.73 54.61,24.13 53.34,24.13 52.07,13.97 53.34,13.97 54.61,13.97 52.07,15.24 53.34,15.24 54.61,15.24 52.07,17.78 53.34,17.78 54.61,17.78 52.07,16.51 53.34,16.51 54.61,16.51 29.1,8.77 29.64,6.76 23.02,9.57 29.51,16.13 12.19,11.18 11.43,4.06 11.3,12.32 21.3,3.51 11.39,22.79 23.24,20.32 37.08,20.32 36.07,20.32 35.31,20.32 31.09,21.31 13.21,6.6 27.48,6.63 34.54,16.26 44.45,8.89 44.45,7.62 44.45,6.35 18.3,13.61 16.78,15.9 15.75,9.65 20.19,20.83
  pour Route2 (no thermals): 55.63,25.4 55.63,0 0,0 -0.05,25.4
  pour Top: 0,0 55.63,0 55.63,25.4 0,25.4
  pour Bottom (rank 2): 0,0 55.63,0 55.63,25.4 0,25.4
  pour Route15: 0.51,16.51 2.29,16.51 2.29,8.89 0.51,8.89
LNA_N
  Top 0.254: 42.01,11.9 U2.20 43.12,11.92 U5.1
LNA_P
  Top 0.254: U2.19 43.12,11.42 U5.2
N$1
  Top 0.203: U2.6 36.14,11.42 C61.1
N$2
  Top 0.203: U2.14 40.27,8.28 R141.2
N$3
  Top 0.203: C231.1 42.8,15.24 42.7,15.14 42.6,15.01 42.16,14.48 42.09,14.01 U2.24
N$4
  Top 0.203: U2.23 42.6,13.42 42.88,13.69 42.88,14.55 43.05,14.73 43.66,14.73 44.29,15.36 C231.2
N$5
  Top 0.203: U2.21 42.95,12.42 43.71,13.18 43.71,13.36 43.89,13.54 C211.1
N$6
  Top 0.254: R3.1 1.92,7.24 D11.A
N$7
  Top 0.203: C173.1 R171.2 42.78,6.99 43.26,6.99 L171.2
N$8
  Top 0.203: 48.77,12.19 48.24,12.17
  Top 0.254: 48.24,12.17 48.18,12.17 | 48.18,12.17 R18.2 | 48.18,12.17 R18.2 R20.2
  Top 0.406: C203.1 R7.2 51.17,21.58 50.8,21.21 50.8,13.59 49.66,12.83 48.77,12.19 | 53.47,21.58 C203.1 | C203.1
N$10
  Top 0.305: 5.57,16.66 4.7,17.27 4.32,17.53
  Top 0.406: F1.2 5.57,16.66 | 4.32,17.53 4.06,18.03 | 4.06,18.03 | 4.06,18.03 4.06,18.04 D2.2
N$11
  Top 0.254: 45.97,10.92 44.74,10.92 U5.7 | R18.1 R17.1
  Top 0.305: 46.22,11.17 45.97,10.92
  Top 0.406: R18.1 46.22,11.17
N$13
  Top 0.254: R19.2 | R19.2
  Top 0.406: R19.2 48.14,8.07 U7.P$3
N$14
  Top 0.203: U2.31 38.27,15.3 38.02,15.54 37.24,15.62 36.73,16.03 36.6,16.38 X2.1 34.77,17.33 C311.1
N$15
  Top 0.203: U2.26 40.77,15.34 41.27,15.85 C261.1
N$16
  Top 0.203: U2.30 38.77,15.36 38.1,16.03 38.1,18.34 37.92,18.52 37.26,18.52 X2.3 37.23,18.53 36.83,18.92 36.83,19.45 C301.1
N$17
  Top 0.203: U2.29 39.27,15.49 38.76,16 38.66,16.08 38.51,16.23 C291.1
N$18
  Top 0.203: R9.1 28.95,7.62 29.92,8.19 31.58,8.82 31.96,9.25 32.34,9.61 LED1.1
N$20
  Top 0.203: R2.1 27.69,9.91 28.19,9.85 29.31,9.85 LED1.4
N$35
  Top 0.203: U3.45 13.01,11.99 11.56,11.68 11.3,11.65 C42.2 9.94,10.66 X1.P$3
N$36
  Top 0.203: U3.46 14.29,11.49 12.55,9.86 12.55,8.27 11.54,7.37 X1.P$1 11.15,6.18 C43.2
PA
  Top 0.203: L171.1 43.23,8.98 43.23,10.29 U5.4
  Top 0.254: U2.17 43.12,10.42 U5.4
PROG
  Top 0.254: R8.1 4.84,8.26 U4.5
RAW  (via drill 0.3, 0.41)
  Top 0.254: R5.2 15.82,4.14 v15.75,4.06
  Top 0.305: U1.1 6.86,21.97 5.84,21.97 U1.3
  Top 0.406: D2.1 1.91,19.18 1.92,19.42 C2.2 1.89,20.69 2.79,21.59 4.57,21.59 v4.83,21.34 | v4.83,21.34 4.96,21.84 4.96,23.48 5.08,23.6 JP2.19 | U1.3 v4.83,21.34 | v5.33,4.83 7.37,4.83 7.62,5.08 7.62,6.16 U4.3
  Route15 0.254: v15.75,4.06 15.24,4.06 14.22,5.08 5.58,5.08 v5.33,4.83
  Route15 0.406: v5.33,4.83 5.33,9.16 4.4,10.54 4.4,20.15 v4.83,21.34
RST  (via drill 0.3)
  Top 0.203: U2.2 35.5,13.42 35.05,13.56 34.04,13.56 33.53,13.97 33.53,15.81 v33.2,16.64 | U3.29 20.24,18.46 v20.19,18.91
  Route15 0.203: v20.19,18.91 27.9,18.03 32.16,17.28 v33.2,16.64
  Bottom 0.305: v20.19,18.91 18.61,20 14.64,20 13.68,21.22 11.04,21.22 10.16,22.1 JP2.17
S0/UVCCDIV  (via drill 0.3)  (1 unrouted)
  Top 0.203: U3.23 24.29,15.49 26.01,17.12 27.17,17.83 28.04,17.98 v30.09,18.69
  Top 0.254: R22.2 R21.1 | 14.23,19.55 v14.48,19.3
  Route15 0.203: JP2.5 40.64,23.62 39.12,22.1 35.31,22.1 32.77,20.57 31.85,19.86 v30.09,18.69 29.22,19.56 22.1,19.56 21.59,19.91 17.27,19.91 16.51,19.3 v14.48,19.3
S1/R  (via drill 0.3)
  Top 0.203: U3.12 22.24,8.24 22.61,7.87 23.01,7.87 24.9,7.87 R9.2 | JP2.4 41.65,22.6 35.6,22.6 32.77,20.32 v27.18,20.32
  Top 0.254: v23.01,8.64 23.01,7.87
  Route2 0.203: v23.01,8.64 23.11,8.64 23.62,9.14 23.62,16.76 v27.18,20.32
S2/B  (via drill 0.3)
  Top 0.203: U3.36 16.48,17.55 v16.26,18.03 | v28.9,16.71 R10.2 29.46,17.42 31.24,18.03 v32.47,18.2
  Route15 0.203: v16.26,18.03 19.05,17.53 23.46,17.46 26.67,17.16 v28.9,16.71
  Bottom 0.203: v32.47,18.2 32.77,20.83 33.02,21.08 35.31,22.61 45.21,22.61 45.72,23.11 JP2.3
S3/G  (via drill 0.3)
  Top 0.203: R2.2 25.02,10.06 24.31,10.99 U3.14 22.9,11 22.7,11.2 22.83,16.13 26.1,19.4 32.95,19.4 33.25,19.35 v33.7,19.1
  Bottom 0.203: JP2.2 48.26,22.86 47.5,22.1 35.56,22.1 34.04,20.83 33.78,20.57 33.78,19.18 v33.7,19.1
S4/IO0  (via drill 0.3)
  Top 0.203: 38.27,9.32 U2.10 38.27,9.06 34.92,5.84 34.05,5.62 | 34.05,5.62 33.42,5.54 v33.22,5.33 | v34.05,4.21 34.05,5.62 | U3.15 24.45,11.49 24.95,11.02 v25.18,10.82
  Route2 0.203: v27.2,5 32.43,5 v33.22,5.33
  Route15 0.203: v34.05,4.21 35.81,2.69 46.99,2.69 48.26,1.52 JP4.19
  Bottom 0.203: v25.18,10.82 25.06,10.83 24.43,10.32 24.21,9.62 24.21,8.08 24.28,7.38 25.11,6.15 26.2,5.5 v27.2,5
S5/IO3  (via drill 0.3)
  Top 0.203: U2.3 34.84,12.92 v34.8,12.95 | U3.20 28.47,13.99 v29.46,14.99
  Bottom 0.203: JP4.18 45.4,1.59 45.4,2 44.7,2.7 42.9,2.7 42.3,3.3 37.37,3.3 36.07,4.29 36.07,5.09 35.75,5.77 34.92,6.48 34.92,12.32 v34.8,12.95 33.02,14.99 31.24,15.24 v29.46,14.99
S6/IO2  (via drill 0.3)
  Top 0.203: U2.4 35.97,12.42 35.81,12.35 33.76,12.35 33.27,11.35 33.27,9.4 v33.02,8.51 | U3.21 27.39,14.49 arc45 27.75,14.64 v27.79,14.69
  Bottom 0.203: 41.46,2.79 36.84,2.79 | 36.84,2.79 34.29,5.2 33.89,6.46 33.74,6.84 v33.02,8.51 | 43.18,1.78 JP4.17 | 36.84,2.79 36.8,2.79 36.79,2.8 31.64,2.8 29.39,4.92 27.25,5.68 25.51,6.63 24.77,8 24.77,9.27 25.53,10.29 26.78,11.33 26.8,13.72 v27.79,14.69
  Bottom 0.254: 41.46,2.79 43.18,1.78
S7/CS  (via drill 0.3)
  Top 0.203: U2.11 38.77,8.93 36.32,6.48 36.32,6.1 | 36.32,6.1 36.32,5.46 36.31,4.23 37.14,3.33 38.58,2.84 40.37,2.14 JP4.16 | v35.29,5.21 36.32,6.1 | U3.22 24.9,14.99 25.4,15.49 v28.45,15.49
  Bottom 0.203: v35.29,5.21 34.67,5.71 34.16,7.37 33.78,8.76 31.8,10.51 30.41,10.89 29.59,12.06 29.59,13.34 28.96,14.17 28.45,15.19 v28.45,15.49
S8/SI  (via drill 0.3)
  Top 0.203: U2.7 36.34,10.92 36.17,10.62 36.17,9.2 34.27,7.54 33.02,7.49 v32.26,7.45 | U3.17 24.84,12.49 25.7,11.84 v28.85,11.84 | v32.57,4.12 33.74,3.5 34.34,3.15 36.31,2.93 37.82,1.98 38.1,1.7 JP4.15
  Top 0.254: v32.26,7.45 32.38,7.37
  Bottom 0.203: v32.57,4.12 32.52,5.87 32.4,7.39 v32.26,7.45 31.68,8.54 31.02,9.3 29.31,11.51 v28.85,11.84
S9/SO  (via drill 0.3)
  Top 0.203: U2.9 37.77,9.2 37.34,8.89 37.34,8.71 34.62,6.3 v31.54,5.95 31.66,5.44 31.67,3.44 34.32,2.33 35.26,1.79 JP4.14 | U3.19 25.94,13.49 26.16,13.46 v27.72,13.46
  Bottom 0.203: v27.72,13.46 27.72,10.61 28.4,9.48 28.4,6.8 29.2,6.05 30.86,5.8 v31.54,5.95
S10/CK  (via drill 0.3)
  Top 0.203: U2.8 37.05,9.95 36.88,9.78 36.88,9.09 34.44,6.88 30.82,6.86 | U3.16 24.71,11.99 25.57,11.33 27.94,11.33 v28.8,10.64 | 30.82,6.86 v30.47,7.17 | JP4.13 33.02,1.58 30.7,3.1 30.7,6.76 30.82,6.86
  Bottom 0.203: v28.8,10.64 29.48,9.78 29.96,8.91 v30.47,7.17
S11/A5  (via drill 0.3)
  Top 0.203: U3.4 18.24,7.08 17.89,6.37 17.68,5.29 R6.2 R5.1 17.64,3.58 v16.9,2.8
  Bottom 0.203: JP4.12 28.95,2.8 v16.9,2.8
STAT
  Top 0.254: U4.1 5.28,5.84 2.04,5.84 2.03,5.84 1.44,5.84 D11.C
TRX_SW
  Top 0.254: U2.18 43.12,10.92 U5.3
U7
  Top 0.203: R10.1 30.47,16.02 LED1.3
UDDC_+
  Top 0.203: U3.44 12.88,12.49 11.3,12.95 10.16,12.95 R4.2
UDDC_-
  Top 0.203: U3.43 12.87,12.99 11.3,13.46 10.03,13.97 R1.2
UDDM  (via drill 0.3)
  Top 0.203: v6.48,13.59 7.63,13.97
  Top 0.254: R1.1 7.63,13.97 6.22,13.34 4.18,13.35 U$2.D-
  Route2 0.203: v6.48,13.59 7.87,12.83 8.34,12.14 8.85,11.33 8.85,4.22 10.16,2.29 JP4.4
UDDP  (via drill 0.3)
  Top 0.254: v7.01,10.98 7.11,11.43 7.62,12.19 R4.1 8.01,12.7 U$2.D+
  Route2 0.203: v7.01,10.98 7.08,9.51 7.04,8.83 7.11,3.3 7.62,2.03 JP4.3
UVCC  (via drill 0.3)
  Top 0.254: 4.63,14 5.51,14.13 v5.63,14.1 5.54,14.18 5.69,14.18 4.17,14 U$2.VBUS | U4.4 7.5,8.51 6.1,7.62 5.12,7.62 R3.2 4.06,7.12 v4.06,6.6 | R21.2 13.97,18.03 v14.22,17.78 | v7.62,15.75 F1.1
  Top 0.406: 5.69,14.18 6.96,14.81 F1.1 | v5.71,11.18 6.99,9.39 U4.4
  Route15 0.254: v5.71,11.18 5.59,12.14 v5.63,14.1 | v14.22,17.78 9.91,17.78 v7.62,15.75
  Bottom 0.254: v4.06,6.6 3.81,6.6 3.81,3.94
  Bottom 0.305: 3.81,3.94 5.08,2.67 JP4.2

### Text on the board
tPlace: GND | RAW | VCC | RST | D0 | D1 | D2 | D3 | D4 | D5 | D6 | D7 | D8 | D9 | D10 | S0 | S1 | S2 | S3 | GND | Flutter | Early Backer / Special Edition | Wireless | C TLA | OSHW | GND | UVCC | D+ | D- | B1 | B2 | A0 | A1 | A2 | A3 | A4 | S11 | S10 | S9 | S8 | S7 | S6 | S5 | S4 | GND
tNames: Released under the Creative Commons Attribution Share-Alike 4.0 License / http://creativecommons.org/licenses/by-sa/4.0/ / Designed by: Taylor Alexander of Flutter Wireless, Inc.